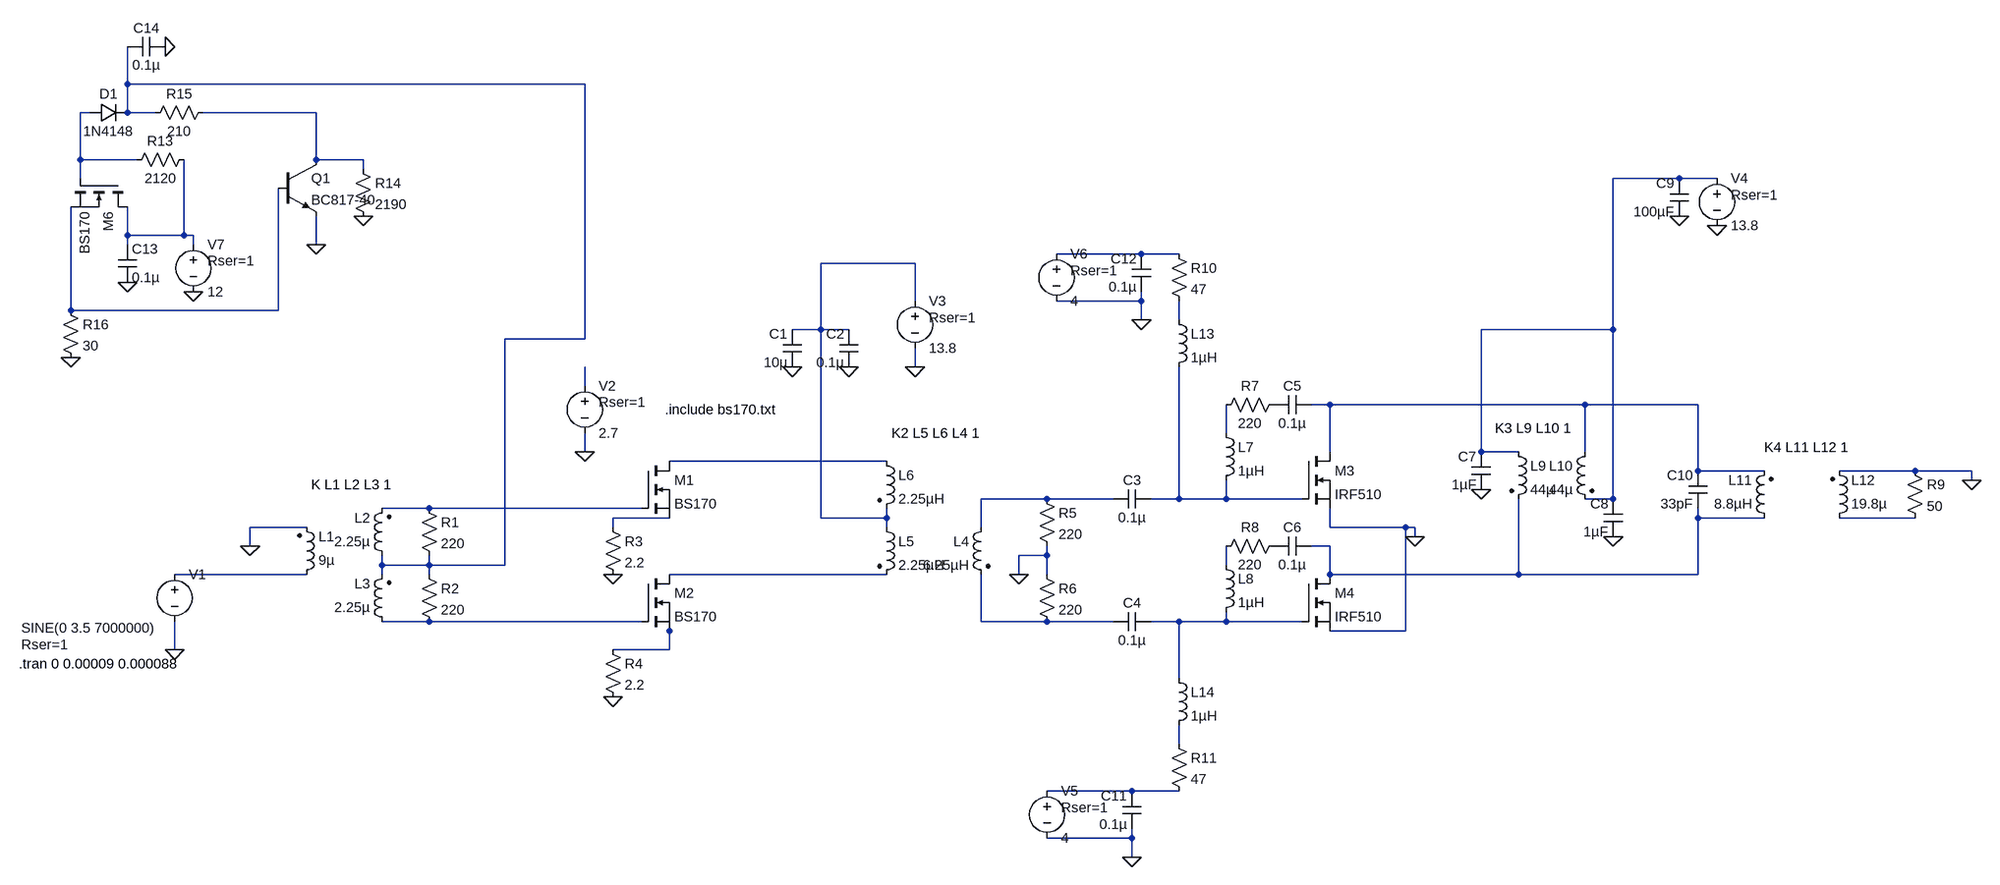
[diagram p0: schematic qlab 10w complete.asc]
qlab 10w complete.asc, the LTspice schematic file:
Version 4
SHEET 1 2916 680
WIRE -240 -704 -240 -768
WIRE 544 -704 -240 -704
WIRE -304 -656 -320 -656
WIRE -240 -656 -240 -704
WIRE -192 -656 -240 -656
WIRE 80 -656 -112 -656
WIRE -320 -576 -320 -656
WIRE -224 -576 -320 -576
WIRE 80 -576 80 -656
WIRE 160 -576 80 -576
WIRE 160 -560 160 -576
WIRE -320 -544 -320 -576
WIRE 2400 -544 2288 -544
WIRE 2464 -544 2400 -544
WIRE -240 -448 -240 -496
WIRE -144 -448 -144 -576
WIRE -144 -448 -240 -448
WIRE -128 -448 -144 -448
WIRE -240 -432 -240 -448
WIRE -128 -432 -128 -448
WIRE 80 -432 80 -480
WIRE 1488 -416 1344 -416
WIRE 1552 -416 1488 -416
WIRE 1104 -400 944 -400
WIRE 1104 -336 1104 -400
WIRE 1488 -336 1488 -352
WIRE 1488 -336 1344 -336
WIRE -336 -320 -336 -496
WIRE 16 -320 16 -528
WIRE 16 -320 -336 -320
WIRE 1488 -304 1488 -336
WIRE 1552 -304 1552 -336
WIRE 944 -288 944 -400
WIRE 944 -288 896 -288
WIRE 992 -288 944 -288
WIRE 2288 -288 2288 -544
WIRE 2288 -288 2064 -288
WIRE 544 -272 544 -704
WIRE 544 -272 400 -272
WIRE 1104 -224 1104 -256
WIRE 544 -192 544 -224
WIRE 1808 -160 1776 -160
WIRE 2240 -160 1808 -160
WIRE 2432 -160 2240 -160
WIRE 1632 -112 1632 -160
WIRE 544 -80 544 -112
WIRE 1808 -80 1808 -160
WIRE 2064 -80 2064 -288
WIRE 2128 -80 2064 -80
WIRE 2240 -80 2240 -160
WIRE 1056 -64 688 -64
WIRE 2432 -48 2432 -160
WIRE 2544 -48 2432 -48
WIRE 2800 -48 2672 -48
WIRE 2896 -48 2800 -48
WIRE 2896 -32 2896 -48
WIRE 1328 0 1216 0
WIRE 1440 0 1328 0
WIRE 1552 0 1552 -224
WIRE 1552 0 1504 0
WIRE 1632 0 1632 -32
WIRE 1632 0 1552 0
WIRE 1760 0 1632 0
WIRE 2288 0 2288 -288
WIRE 2288 0 2240 0
WIRE 272 16 192 16
WIRE 640 16 272 16
WIRE 688 32 592 32
WIRE 944 32 944 -288
WIRE 1056 32 1056 16
WIRE 1056 32 944 32
WIRE 2432 32 2432 16
WIRE 2544 32 2432 32
WIRE 2800 32 2672 32
WIRE 64 48 -32 48
WIRE 592 48 592 32
WIRE 1056 48 1056 32
WIRE 1216 48 1216 0
WIRE 1808 48 1808 16
WIRE 1936 48 1808 48
WIRE 1952 48 1936 48
WIRE 1952 64 1952 48
WIRE -32 80 -32 48
WIRE 1808 80 1776 80
WIRE 1328 96 1328 80
WIRE 1328 96 1280 96
WIRE 192 112 192 96
WIRE 272 112 272 96
WIRE 272 112 192 112
WIRE 400 112 400 -272
WIRE 400 112 272 112
WIRE 1632 112 1632 80
WIRE 64 128 -160 128
WIRE 192 128 192 112
WIRE 272 128 272 112
WIRE 1056 128 688 128
WIRE 1280 128 1280 96
WIRE 1328 128 1328 96
WIRE 1808 128 1808 80
WIRE 2128 128 2128 0
WIRE 2128 128 1808 128
WIRE 2432 128 2432 32
WIRE 2432 128 2128 128
WIRE 272 208 192 208
WIRE 640 208 272 208
WIRE 1216 208 1216 128
WIRE 1328 208 1216 208
WIRE 1440 208 1328 208
WIRE 1552 208 1504 208
WIRE 1632 208 1632 192
WIRE 1632 208 1552 208
WIRE 1760 208 1632 208
WIRE 688 224 688 208
WIRE 1936 224 1936 48
WIRE 1936 224 1808 224
WIRE -160 256 -160 208
WIRE 688 256 688 224
WIRE 688 256 592 256
WIRE 1552 304 1552 208
WIRE 1552 416 1552 384
WIRE 1472 496 1328 496
WIRE 1552 496 1472 496
WIRE 1472 576 1472 560
WIRE 1472 576 1328 576
WIRE 1472 608 1472 576
FLAG -160 256 0
FLAG -32 80 0
FLAG 544 -80 0
FLAG 592 128 0
FLAG 592 336 0
FLAG 1104 -224 0
FLAG 1280 128 0
FLAG 896 -224 0
FLAG 992 -224 0
FLAG 1952 64 0
FLAG 2064 -16 0
FLAG 2288 64 0
FLAG 2464 -464 0
FLAG 2400 -480 0
FLAG 1472 608 0
FLAG 1488 -304 0
FLAG 2896 -32 0
FLAG -240 -368 0
FLAG -128 -352 0
FLAG -336 -240 0
FLAG 80 -432 0
FLAG 160 -480 0
FLAG -176 -768 0
DATAFLAG 544 16 ""
DATAFLAG 448 208 ""
DATAFLAG 864 -64 ""
DATAFLAG 1536 0 ""
DATAFLAG 1600 0 ""
DATAFLAG 1584 208 ""
DATAFLAG 1984 -160 ""
DATAFLAG 2000 128 ""
DATAFLAG 1424 -416 ""
SYMBOL ind2 48 144 M180
WINDOW 0 36 80 Left 2
WINDOW 3 36 40 Left 2
SYMATTR InstName L1
SYMATTR Value 9µ
SYMATTR Type ind
SYMBOL ind2 208 224 R180
WINDOW 0 36 80 Left 2
WINDOW 3 36 40 Left 2
SYMATTR InstName L3
SYMATTR Value 2.25µ
SYMATTR Type ind
SYMBOL ind2 208 112 R180
WINDOW 0 36 80 Left 2
WINDOW 3 36 40 Left 2
SYMATTR InstName L2
SYMATTR Value 2.25µ
SYMATTR Type ind
SYMBOL voltage -160 112 R0
WINDOW 3 -260 107 Left 2
WINDOW 123 0 0 Left 0
WINDOW 39 -260 135 Left 2
SYMATTR Value SINE(0 3.5 7000000)
SYMATTR SpiceLine Rser=1
SYMATTR InstName V1
SYMBOL res 256 0 R0
SYMATTR InstName R1
SYMATTR Value 220
SYMBOL res 256 112 R0
SYMATTR InstName R2
SYMATTR Value 220
SYMBOL voltage 544 -208 R0
WINDOW 123 0 0 Left 0
WINDOW 39 24 44 Left 2
SYMATTR SpiceLine Rser=1
SYMATTR InstName V2
SYMATTR Value 2.7
SYMBOL nmos 640 -64 R0
SYMATTR InstName M1
SYMATTR Value BS170
SYMATTR Prefix X
SYMBOL nmos 640 128 R0
SYMATTR InstName M2
SYMATTR Value BS170
SYMATTR Prefix X
SYMBOL res 576 32 R0
SYMATTR InstName R3
SYMATTR Value 2.2
SYMBOL res 576 240 R0
SYMATTR InstName R4
SYMATTR Value 2.2
SYMBOL ind2 1232 32 M0
SYMATTR InstName L4
SYMATTR Value 6.25µH
SYMATTR Type ind
SYMBOL ind2 1040 32 R0
SYMATTR InstName L5
SYMATTR Value 2.25µH
SYMATTR Type ind
SYMBOL ind2 1040 -80 R0
SYMATTR InstName L6
SYMATTR Value 2.25µH
SYMATTR Type ind
SYMBOL voltage 1104 -352 R0
WINDOW 123 0 0 Left 0
WINDOW 39 24 44 Left 2
SYMATTR SpiceLine Rser=1
SYMATTR InstName V3
SYMATTR Value 13.8
SYMBOL res 1312 -16 R0
SYMATTR InstName R5
SYMATTR Value 220
SYMBOL res 1312 112 R0
SYMATTR InstName R6
SYMATTR Value 220
SYMBOL cap 912 -224 R180
WINDOW 0 24 56 Left 2
WINDOW 3 24 8 Left 2
SYMATTR InstName C1
SYMATTR Value 10µ
SYMBOL cap 1008 -224 R180
WINDOW 0 24 56 Left 2
WINDOW 3 24 8 Left 2
SYMATTR InstName C2
SYMATTR Value 0.1µ
SYMBOL cap 1504 -16 R90
WINDOW 0 0 32 VBottom 2
WINDOW 3 32 32 VTop 2
SYMATTR InstName C3
SYMATTR Value 0.1µ
SYMBOL cap 1504 192 R90
WINDOW 0 0 32 VBottom 2
WINDOW 3 32 32 VTop 2
SYMATTR InstName C4
SYMATTR Value 0.1µ
SYMBOL nmos 1760 -80 R0
SYMATTR InstName M3
SYMATTR Value IRF510
SYMBOL nmos 1760 128 R0
SYMATTR InstName M4
SYMATTR Value IRF510
SYMBOL cap 1776 -176 R90
WINDOW 0 0 32 VBottom 2
WINDOW 3 32 32 VTop 2
SYMATTR InstName C5
SYMATTR Value 0.1µ
SYMBOL cap 1776 64 R90
WINDOW 0 0 32 VBottom 2
WINDOW 3 32 32 VTop 2
SYMATTR InstName C6
SYMATTR Value 0.1µ
SYMBOL res 1728 -176 R90
WINDOW 0 0 56 VBottom 2
WINDOW 3 32 56 VTop 2
SYMATTR InstName R7
SYMATTR Value 220
SYMBOL res 1728 64 R90
WINDOW 0 0 56 VBottom 2
WINDOW 3 32 56 VTop 2
SYMATTR InstName R8
SYMATTR Value 220
SYMBOL ind 1616 -128 R0
SYMATTR InstName L7
SYMATTR Value 1µH
SYMBOL ind 1616 96 R0
SYMATTR InstName L8
SYMATTR Value 1µH
SYMBOL ind2 2112 -96 R0
SYMATTR InstName L9
SYMATTR Value 44µ
SYMATTR Type ind
SYMATTR SpiceLine Rser=0.1
SYMBOL ind2 2256 -96 M0
SYMATTR InstName L10
SYMATTR Value 44µ
SYMATTR Type ind
SYMATTR SpiceLine Rser=0.1
SYMBOL cap 2080 -16 R180
WINDOW 0 24 56 Left 2
WINDOW 3 24 8 Left 2
SYMATTR InstName C7
SYMATTR Value 1µF
SYMBOL cap 2304 64 R180
WINDOW 0 24 56 Left 2
WINDOW 3 24 8 Left 2
SYMATTR InstName C8
SYMATTR Value 1µF
SYMBOL voltage 2464 -560 R0
WINDOW 123 0 0 Left 0
WINDOW 39 24 44 Left 2
SYMATTR SpiceLine Rser=1
SYMATTR InstName V4
SYMATTR Value 13.8
SYMBOL cap 2416 -480 R180
WINDOW 0 24 56 Left 2
WINDOW 3 24 8 Left 2
SYMATTR InstName C9
SYMATTR Value 100µF
SYMBOL cap 2448 16 R180
WINDOW 0 24 56 Left 2
WINDOW 3 24 8 Left 2
SYMATTR InstName C10
SYMATTR Value 33pF
SYMBOL ind2 2560 48 R180
WINDOW 0 36 80 Left 2
WINDOW 3 36 40 Left 2
SYMATTR InstName L11
SYMATTR Value 8.8µH
SYMATTR Type ind
SYMATTR SpiceLine Rser=0.1
SYMBOL ind2 2656 48 M180
WINDOW 0 36 80 Left 2
WINDOW 3 36 40 Left 2
SYMATTR InstName L12
SYMATTR Value 19.8µ
SYMATTR Type ind
SYMATTR SpiceLine Rser=0.1
SYMBOL res 2784 -64 R0
SYMATTR InstName R9
SYMATTR Value 50
SYMBOL ind 1536 -320 R0
SYMATTR InstName L13
SYMATTR Value 1µH
SYMBOL ind 1536 288 R0
SYMATTR InstName L14
SYMATTR Value 1µH
SYMBOL res 1536 -432 R0
SYMATTR InstName R10
SYMATTR Value 47
SYMBOL res 1536 400 R0
SYMATTR InstName R11
SYMATTR Value 47
SYMBOL cap 1488 560 R180
WINDOW 0 24 56 Left 2
WINDOW 3 24 8 Left 2
SYMATTR InstName C11
SYMATTR Value 0.1µ
SYMBOL voltage 1328 480 R0
WINDOW 123 0 0 Left 0
WINDOW 39 24 44 Left 2
SYMATTR SpiceLine Rser=1
SYMATTR InstName V5
SYMATTR Value 4
SYMBOL cap 1504 -352 R180
WINDOW 0 24 56 Left 2
WINDOW 3 24 8 Left 2
SYMATTR InstName C12
SYMATTR Value 0.1µ
SYMBOL voltage 1344 -432 R0
WINDOW 123 0 0 Left 0
WINDOW 39 24 44 Left 2
SYMATTR SpiceLine Rser=1
SYMATTR InstName V6
SYMATTR Value 4
SYMBOL nmos -240 -544 R90
SYMATTR InstName M6
SYMATTR Value BS170
SYMATTR Prefix X
SYMBOL npn 16 -576 R0
SYMATTR InstName Q1
SYMATTR Value BC817-40
SYMBOL diode -304 -640 R270
WINDOW 0 32 32 VTop 2
WINDOW 3 0 32 VBottom 2
SYMATTR InstName D1
SYMATTR Value 1N4148
SYMBOL res -128 -592 R90
WINDOW 0 0 56 VBottom 2
WINDOW 3 32 56 VTop 2
SYMATTR InstName R13
SYMATTR Value 2120
SYMBOL res 144 -576 R0
SYMATTR InstName R14
SYMATTR Value 2190
SYMBOL res -96 -672 R90
WINDOW 0 0 56 VBottom 2
WINDOW 3 32 56 VTop 2
SYMATTR InstName R15
SYMATTR Value 210
SYMBOL res -352 -336 R0
SYMATTR InstName R16
SYMATTR Value 30
SYMBOL cap -256 -432 R0
SYMATTR InstName C13
SYMATTR Value 0.1µ
SYMBOL cap -176 -784 R90
WINDOW 0 0 32 VBottom 2
WINDOW 3 32 32 VTop 2
SYMATTR InstName C14
SYMATTR Value 0.1µ
SYMBOL voltage -128 -448 R0
WINDOW 123 0 0 Left 0
WINDOW 39 24 44 Left 2
SYMATTR SpiceLine Rser=1
SYMATTR InstName V7
SYMATTR Value 12
TEXT -424 280 Left 2 !.tran 0 0.00009 0.000088
TEXT 72 -24 Left 2 !K L1 L2 L3 1
TEXT 1064 -112 Left 2 !K2 L5 L6 L4 1
TEXT 680 -152 Left 2 !.include bs170.txt
TEXT 2088 -120 Left 2 !K3 L9 L10 1
TEXT 2544 -88 Left 2 !K4 L11 L12 1

The netlist it stands for:
* qlab 10w complete.asc
L1 N021 0 9µ
L3 N023 N001 2.25µ
L2 N001 N016 2.25µ
V1 N021 0 SINE(0 3.5 7000000) Rser=1
R1 N016 N001 220
R2 N001 N023 220
V2 N010 0 2.7 Rser=1
XM1 N013 N016 N017 BS170  ; pins D G S
XM2 N022 N023 N026 BS170  ; pins D G S
R3 N017 0 2.2
R4 N026 0 2.2
L4 N014 N024 6.25µH
L5 N007 N022 2.25µH
L6 N013 N007 2.25µH
V3 N007 0 13.8 Rser=1
R5 N014 0 220
R6 0 N024 220
C1 0 N007 10µ
C2 0 N007 0.1µ
C3 N015 N014 0.1µ
C4 N025 N024 0.1µ
M3 N011 N015 0 0 IRF510
M4 N018 N025 0 0 IRF510
C5 N011 P001 0.1µ
C6 N018 P002 0.1µ
R7 P001 N012 220
R8 P002 N020 220
L7 N012 N015 1µH
L8 N020 N025 1µH
L9 N004 N018 44µ Rser=0.1
L10 N011 N004 44µ Rser=0.1
C7 0 N004 1µF
C8 0 N004 1µF
V4 N004 0 13.8 Rser=1
C9 0 N004 100µF
C10 N018 N011 33pF
L11 N018 N011 8.8µH Rser=0.1
L12 N019 0 19.8µ Rser=0.1
R9 0 N019 50
L13 N009 N015 1µH
L14 N025 N027 1µH
R10 N006 N009 47
R11 N027 N028 47
C11 0 N028 0.1µ
V5 N028 0 4 Rser=1
C12 0 N006 0.1µ
V6 N006 0 4 Rser=1
XM6 N005 N002 N008 BS170  ; pins D G S
Q1 N003 N008 0 0 BC817-40
D1 N002 N001 1N4148
R13 N005 N002 2120
R14 N003 0 2190
R15 N003 N001 210
R16 N008 0 30
C13 N005 0 0.1µ
C14 0 N001 0.1µ
V7 N005 0 12 Rser=1
.model D D
.lib standard.dio
.model NPN NPN
.model PNP PNP
.lib standard.bjt
.model NMOS NMOS
.model PMOS PMOS
.lib standard.mos
.tran 0 0.00009 0.000088
K L1 L2 L3 1
K2 L5 L6 L4 1
.include bs170.txt
K3 L9 L10 1
K4 L11 L12 1
.backanno
.end